# EAGLE schematic STX3 (EAGLE 6.5.0)
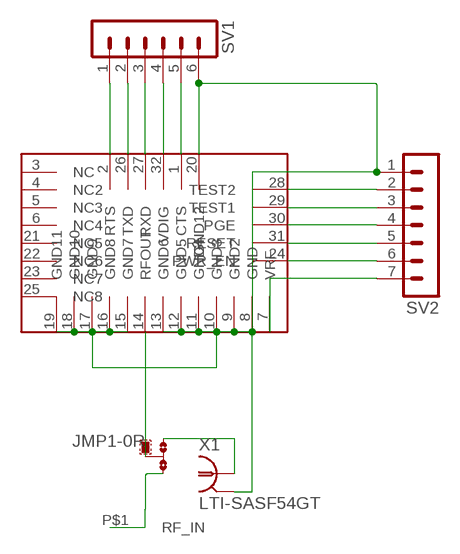
[diagram p0: schematic, sheet 1]

## Parts
JMP1  0R-JUMPC  [C0R-JMP]
SV1  MA06-1  [MA06-1]
SV2  MA07-1  [MA07-1]
U$1  STX3  [STX3]
U$2  GSANTENNA  [GSANTENNA]
X1  LTI-SASF54GT  [LTI-SASF54GT]

## Nets
N$1: SV1.1 U$1.2(RTS)
N$2: SV1.2 U$1.26(TXD)
N$3: SV1.3 U$1.27(RXD)
N$4: SV1.4 U$1.32(VDIG)
N$5: SV1.5 U$1.1(CTS)
N$6: SV2.2 U$1.28(TEST2)
N$7: JMP1.2 U$1.14(RFOUT)
N$8: JMP1.3 U$2.P$1(RF_IN)
N$9: SV2.3 U$1.29(TEST1)
N$10: SV2.4 U$1.30(PGE)
N$11: SV2.5 U$1.31(RESET)
N$12: SV2.6 U$1.24(PWR_EN)
N$13: SV2.7 U$1.7(VRF)
N$15: JMP1.1 X1.1
N$16: SV1.6 SV2.1 U$1.8(GND) U$1.9(GND2) U$1.10(GND3) U$1.11(GND4) U$1.12(GND5) U$1.13(GND6) U$1.15(GND7) U$1.16(GND8) U$1.17(GND9) U$1.18(GND10) U$1.19(GND11) U$1.20(GND12) X1.2 X1.3 X1.4 X1.5
Unconnected: U$1.3(NC) U$1.4(NC2) U$1.5(NC3) U$1.6(NC4) U$1.21(NC5) U$1.22(NC6) U$1.23(NC7) U$1.25(NC8)

## Library data of the parts
JMP1 = jump-0r-smd:0R-JUMP: SMD 0R 0805 Jumper
SV1 = con-lstb:MA06-1: PIN HEADER; OC_FARNELL: unknown; OC_NEWARK: unknown
SV2 = con-lstb:MA07-1: PIN HEADER; OC_FARNELL: unknown; OC_NEWARK: unknown
U$1 = STX3:STX3: GlobalStar STX3 Satellite Transmitter Module
U$2 = STX3:GSANTENNA
X1 = con-coax:LTI-SASF54GT: SMA vertical PCB thrue hole jack Source: Lighthorse Technologies, inc. SASF54GT.pdf; OC_FARNELL: unknown; OC_NEWARK: unknown